# EAGLE design Schematics (EAGLE 8.7.1)
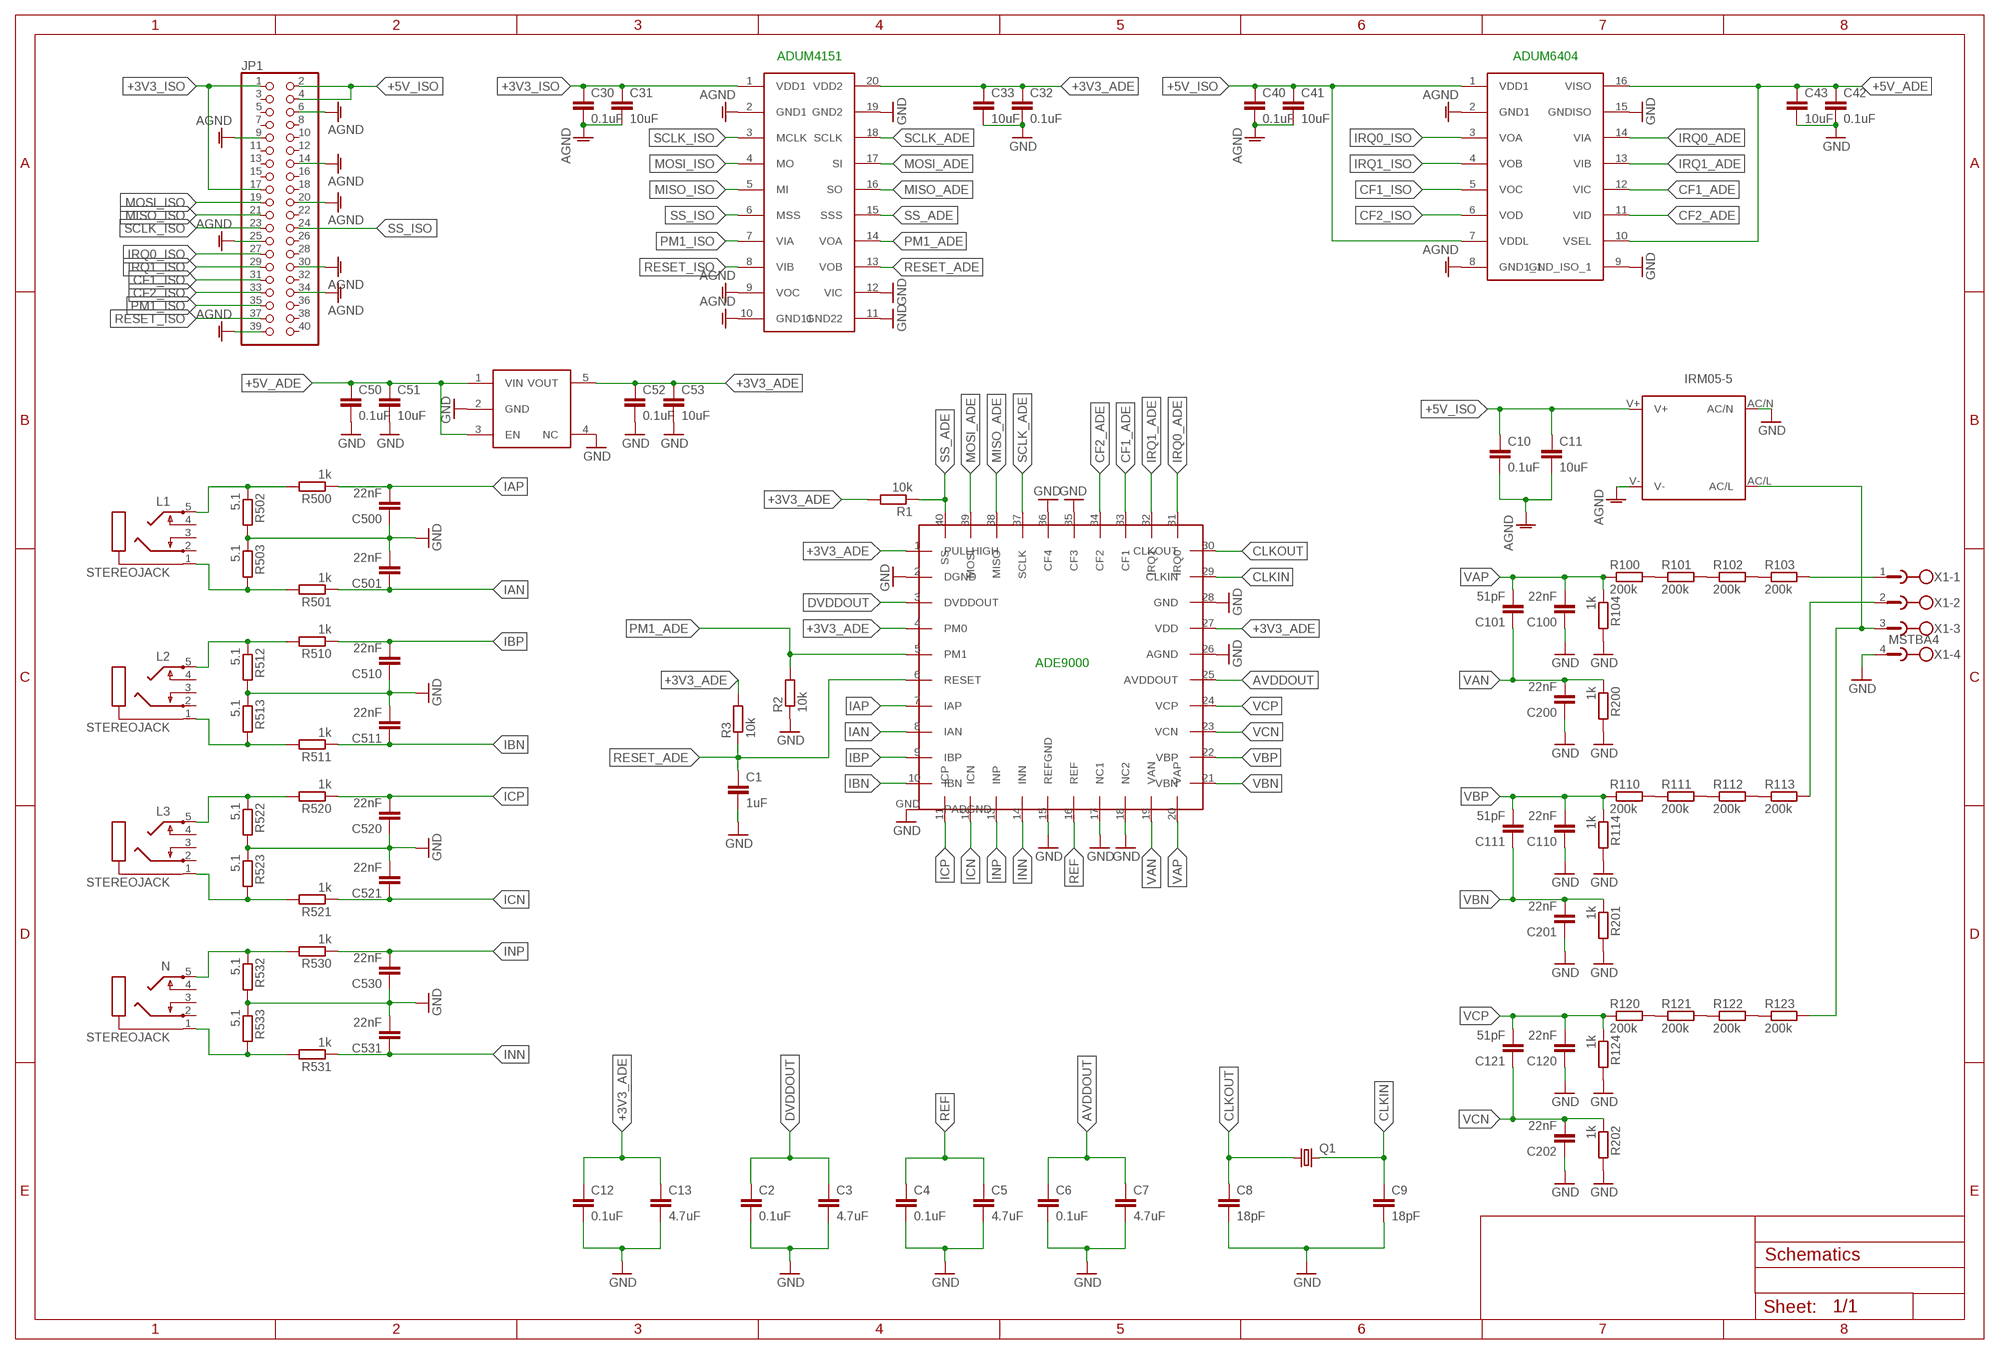
[diagram p0: schematic, sheet 1]

## Parts
ADE9000  ADE9000  [LFCSP40]
ADUM4151  ADUM4151  [SOIC20R]
ADUM6404  ADUM6404  [SOIC16R]
C1  1uF  C-EUC0805  [C0805]
C2  0.1uF  C-EUC0805  [C0805]
C3  4.7uF  C-EUC0805  [C0805]
C4  0.1uF  C-EUC0805  [C0805]
C5  4.7uF  C-EUC0805  [C0805]
C6  0.1uF  C-EUC0805  [C0805]
C7  4.7uF  C-EUC0805  [C0805]
C8  18pF  C-EUC0805  [C0805]
C9  18pF  C-EUC0805  [C0805]
C10  0.1uF  C-EUC0805  [C0805]
C11  10uF  C-EUC0805  [C0805]
C12  0.1uF  C-EUC0805  [C0805]
C13  4.7uF  C-EUC0805  [C0805]
C30  0.1uF  C-EUC0805  [C0805]
C31  10uF  C-EUC0805  [C0805]
C32  0.1uF  C-EUC0805  [C0805]
C33  10uF  C-EUC0805  [C0805]
C40  0.1uF  C-EUC0805  [C0805]
C41  10uF  C-EUC0805  [C0805]
C42  0.1uF  C-EUC0805  [C0805]
C43  10uF  C-EUC0805  [C0805]
C50  0.1uF  C-EUC0805  [C0805]
C51  10uF  C-EUC0805  [C0805]
C52  0.1uF  C-EUC0805  [C0805]
C53  10uF  C-EUC0805  [C0805]
C100  22nF  C-EUC0805  [C0805]
C101  51pF  C-EUC0805  [C0805]
C110  22nF  C-EUC0805  [C0805]
C111  51pF  C-EUC0805  [C0805]
C120  22nF  C-EUC0805  [C0805]
C121  51pF  C-EUC0805  [C0805]
C200  22nF  C-EUC0805  [C0805]
C201  22nF  C-EUC0805  [C0805]
C202  22nF  C-EUC0805  [C0805]
C500  22nF  C-EUC0805  [C0805]
C501  22nF  C-EUC0805  [C0805]
C510  22nF  C-EUC0805  [C0805]
C511  22nF  C-EUC0805  [C0805]
C520  22nF  C-EUC0805  [C0805]
C521  22nF  C-EUC0805  [C0805]
C530  22nF  C-EUC0805  [C0805]
C531  22nF  C-EUC0805  [C0805]
IRM05-5  IRM_05/10  [IRM_05/10]
JP1  PINHD-2X20  [2X20]
L1  STEREOJACK  [STX3100]
L2  STEREOJACK  [STX3100]
L3  STEREOJACK  [STX3100]
N  STEREOJACK  [STX3100]
Q1  CRYSTALCTS406  [CTS406]
R1  10k  R-EU_M0805  [M0805]
R2  10k  R-EU_M0805  [M0805]
R3  10k  R-EU_M0805  [M0805]
R100  200k  R-EU_M1206  [M1206]
R101  200k  R-EU_M1206  [M1206]
R102  200k  R-EU_M1206  [M1206]
R103  200k  R-EU_M1206  [M1206]
R104  1k  R-EU_M0805  [M0805]
R110  200k  R-EU_M1206  [M1206]
R111  200k  R-EU_M1206  [M1206]
R112  200k  R-EU_M1206  [M1206]
R113  200k  R-EU_M1206  [M1206]
R114  1k  R-EU_M0805  [M0805]
R120  200k  R-EU_M1206  [M1206]
R121  200k  R-EU_M1206  [M1206]
R122  200k  R-EU_M1206  [M1206]
R123  200k  R-EU_M1206  [M1206]
R124  1k  R-EU_M0805  [M0805]
R200  1k  R-EU_M0805  [M0805]
R201  1k  R-EU_M0805  [M0805]
R202  1k  R-EU_M0805  [M0805]
R500  1k  R-EU_M0805  [M0805]
R501  1k  R-EU_M0805  [M0805]
R502  5.1  R-EU_M0805  [M0805]
R503  5.1  R-EU_M0805  [M0805]
R510  1k  R-EU_M0805  [M0805]
R511  1k  R-EU_M0805  [M0805]
R512  5.1  R-EU_M0805  [M0805]
R513  5.1  R-EU_M0805  [M0805]
R520  1k  R-EU_M0805  [M0805]
R521  1k  R-EU_M0805  [M0805]
R522  5.1  R-EU_M0805  [M0805]
R523  5.1  R-EU_M0805  [M0805]
R530  1k  R-EU_M0805  [M0805]
R531  1k  R-EU_M0805  [M0805]
R532  5.1  R-EU_M0805  [M0805]
R533  5.1  R-EU_M0805  [M0805]
U$5  ADP122AUJZ-3.3-R7  [TSOT23-5L]
X1  MSTBA4  [MSTBA4]

## Nets
+3V3_ADE: ADE9000.1(PULLHIGH) ADE9000.4(PM0) ADE9000.27(VDD) ADUM4151.20(VDD2) C12.1 C13.1 C32.1 C33.1 C52.1 C53.1 R1.2 R3.2 U$5.5(VOUT)
+3V3_ISO: ADUM4151.1(VDD1) C30.1 C31.1 JP1.1 JP1.17
+5V_ADE: ADUM6404.10(VSEL) ADUM6404.16(VISO) C42.1 C43.1 C50.1 C51.1 U$5.1(VIN) U$5.3(EN)
+5V_ISO: ADUM6404.1(VDD1) ADUM6404.7(VDDL) C10.1 C11.1 C40.1 C41.1 IRM05-5.V+ JP1.2 JP1.4
AGND: ADUM4151.2(GND1) ADUM4151.9(VOC) ADUM4151.10(GND11) ADUM6404.2(GND1) ADUM6404.8(GND1_1) C10.2 C11.2 C30.2 C31.2 C40.2 C41.2 IRM05-5.V- JP1.6 JP1.9 JP1.14 JP1.20 JP1.25 JP1.30 JP1.34 JP1.39
AVDDOUT: ADE9000.25(AVDDOUT) C6.1 C7.1
CF1_ADE: ADE9000.33(CF1) ADUM6404.12(VIC)
CF1_ISO: ADUM6404.5(VOC) JP1.31
CF2_ADE: ADE9000.34(CF2) ADUM6404.11(VID)
CF2_ISO: ADUM6404.6(VOD) JP1.33
CLKIN: ADE9000.29(CLKIN) C9.1 Q1.3
CLKOUT: ADE9000.30(CLKOUT) C8.1 Q1.1
DVDDOUT: ADE9000.3(DVDDOUT) C2.1 C3.1
GND: ADE9000.2(DGND) ADE9000.15(REFGND) ADE9000.17(NC1) ADE9000.18(NC2) ADE9000.26(AGND) ADE9000.28(GND) ADE9000.35(CF3) ADE9000.36(CF4) ADE9000.GND(PADGND) ADUM4151.11(GND22) ADUM4151.12(VIC) ADUM4151.19(GND2) ADUM6404.9(GND_ISO_1) ADUM6404.15(GNDISO) C1.2 C2.2 C3.2 C4.2 C5.2 C6.2 C7.2 C8.2 C9.2 C12.2 C13.2 C32.2 C33.2 C42.2 C43.2 C50.2 C51.2 C52.2 C53.2 C100.1 C110.1 C120.1 C200.1 C201.1 C202.1 C500.1 C501.2 C510.1 C511.2 C520.1 C521.2 C530.1 C531.2 IRM05-5.AC/N R2.1 R104.2 R114.2 R124.2 R200.2 R201.2 R202.2 R502.2 R503.1 R512.2 R513.1 R522.2 R523.1 R532.2 R533.1 U$5.2(GND) U$5.4(NC) X1.4
IAN: ADE9000.8(IAN) C501.1 R501.1
IAP: ADE9000.7(IAP) C500.2 R500.1
IBN: ADE9000.10(IBN) C511.1 R511.1
IBP: ADE9000.9(IBP) C510.2 R510.1
ICN: ADE9000.12(ICN) C521.1 R521.1
ICP: ADE9000.11(ICP) C520.2 R520.1
INN: ADE9000.14(INN) C531.1 R531.1
INP: ADE9000.13(INP) C530.2 R530.1
IRQ0_ADE: ADE9000.31(IRQ0) ADUM6404.14(VIA)
IRQ0_ISO: ADUM6404.3(VOA) JP1.27
IRQ1_ADE: ADE9000.32(IRQ1) ADUM6404.13(VIB)
IRQ1_ISO: ADUM6404.4(VOB) JP1.29
MISO_ADE: ADE9000.38(MISO) ADUM4151.16(SO)
MISO_ISO: ADUM4151.5(MI) JP1.21
MOSI_ADE: ADE9000.39(MOSI) ADUM4151.17(SI)
MOSI_ISO: ADUM4151.4(MO) JP1.19
N$1: R121.2 R122.1
N$3: R102.2 R103.1
N$4: R103.2 X1.1
N$10: L1.5 R500.2 R502.1
N$11: L1.1 R501.2 R503.2
N$12: L2.5 R510.2 R512.1
N$13: L2.1 R511.2 R513.2
N$14: L3.5 R520.2 R522.1
N$15: L3.1 R521.2 R523.2
N$16: N.5 R530.2 R532.1
N$17: N.1 R531.2 R533.2
N$18: R101.2 R102.1
N$19: R111.2 R112.1
N$20: R112.2 R113.1
N$21: R122.2 R123.1
N$22: R113.2 X1.2
N$23: IRM05-5.AC/L R123.2 X1.3
N$29: R110.2 R111.1
N$30: R100.2 R101.1
N$31: R120.2 R121.1
PM1_ADE: ADE9000.5(PM1) ADUM4151.14(VOA) R2.2
PM1_ISO: ADUM4151.7(VIA) JP1.35
REF: ADE9000.16(REF) C4.1 C5.1
RESET_ADE: ADE9000.6(RESET) ADUM4151.13(VOB) C1.1 R3.1
RESET_ISO: ADUM4151.8(VIB) JP1.37
SCLK_ADE: ADE9000.37(SCLK) ADUM4151.18(SCLK)
SCLK_ISO: ADUM4151.3(MCLK) JP1.23
SS_ADE: ADE9000.40(SS) ADUM4151.15(SSS) R1.1
SS_ISO: ADUM4151.6(MSS) JP1.24
VAN: ADE9000.19(VAN) C101.1 C200.2 R200.1
VAP: ADE9000.20(VAP) C100.2 C101.2 R100.1 R104.1
VBN: ADE9000.21(VBN) C111.1 C201.2 R201.1
VBP: ADE9000.22(VBP) C110.2 C111.2 R110.1 R114.1
VCN: ADE9000.23(VCN) C121.1 C202.2 R202.1
VCP: ADE9000.24(VCP) C120.2 C121.2 R120.1 R124.1
Unconnected: JP1.3 JP1.5 JP1.7 JP1.8 JP1.10 JP1.11 JP1.12 JP1.13 JP1.15 JP1.16 JP1.18 JP1.22 JP1.26 JP1.28 JP1.32 JP1.36 JP1.38 JP1.40 L1.2 L1.3 L1.4 L2.2 L2.3 L2.4 L3.2 L3.3 L3.4 N.2 N.3 N.4

## Notes on the sheet
- ADUM4151 | ADUM6404
- ADE9000

## Library data of the parts
ADE9000 = Schematics:ADE9000
ADUM4151 = Schematics:ADUM4151
ADUM6404 = Schematics:ADUM6404
C1-C13 C30-C33 C40-C43 C50-C53 C100 C101 C110 C111 C120 C121 C200-C202 C500 C501 C510 C511 C520 C521 C530 C531 = Schematics:C-EU: CAPACITOR, European symbol
IRM05-5 = Schematics:IRM_05/10: 5 or 10 watt housing & pin compatible IRM 05 Vout [V] Imax [A] Pmax [W] Eff [%] 3.3 1.25 4.125 68 5 1 5 71 12 0.42 5.04 75 15 0.33 4.95 75 24 0.23 5.52 77 IRM 10 Vout [V] Imax [A] Pmax [W] Eff [%] 3.3 2.5 8.25 74 5 2 10 77 12 0.85 10.2 82 15 0.67 10.05 82 24 0.42 10.08 82
JP1 = Schematics:PINHD-2X20: PIN HEADER
L1-L3 N = Schematics:STEREOJACK: MIC/HEADPHONE JACK Stereo jack with two switches. Kycon STX3100, CUI SJ1-3555NG and/or 4UCon 05544
Q1 = Schematics:CRYSTAL: CRYSTAL; OC_FARNELL: unknown; OC_NEWARK: unknown
R1-R3 R100-R104 R110-R114 R120-R124 R200-R202 R500-R503 R510-R513 R520-R523 R530-R533 = Schematics:R-EU_: RESISTOR, European symbol
U$5 = Schematics:ADP122AUJZ-3.3-R7
X1 = Schematics:MSTBA4: PHOENIX; MF: FARNELL; MPN: 1757268; OC_FARNELL: 3705195; OC_NEWARK: 71C4163

## Board
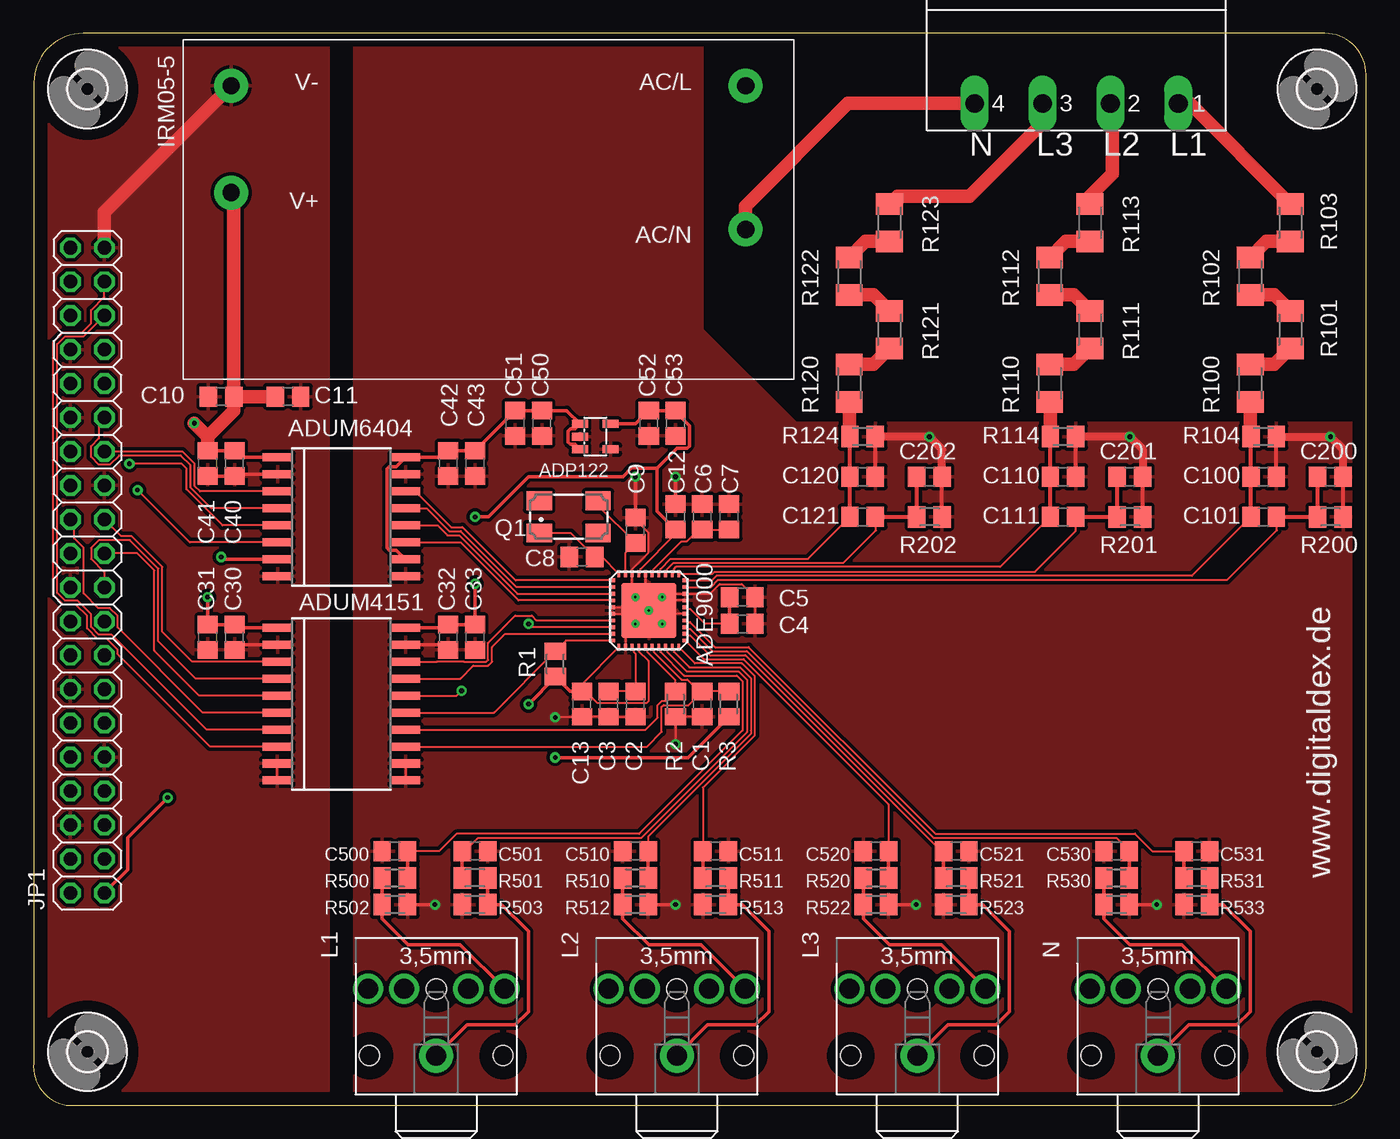
[diagram p1: board, top side]
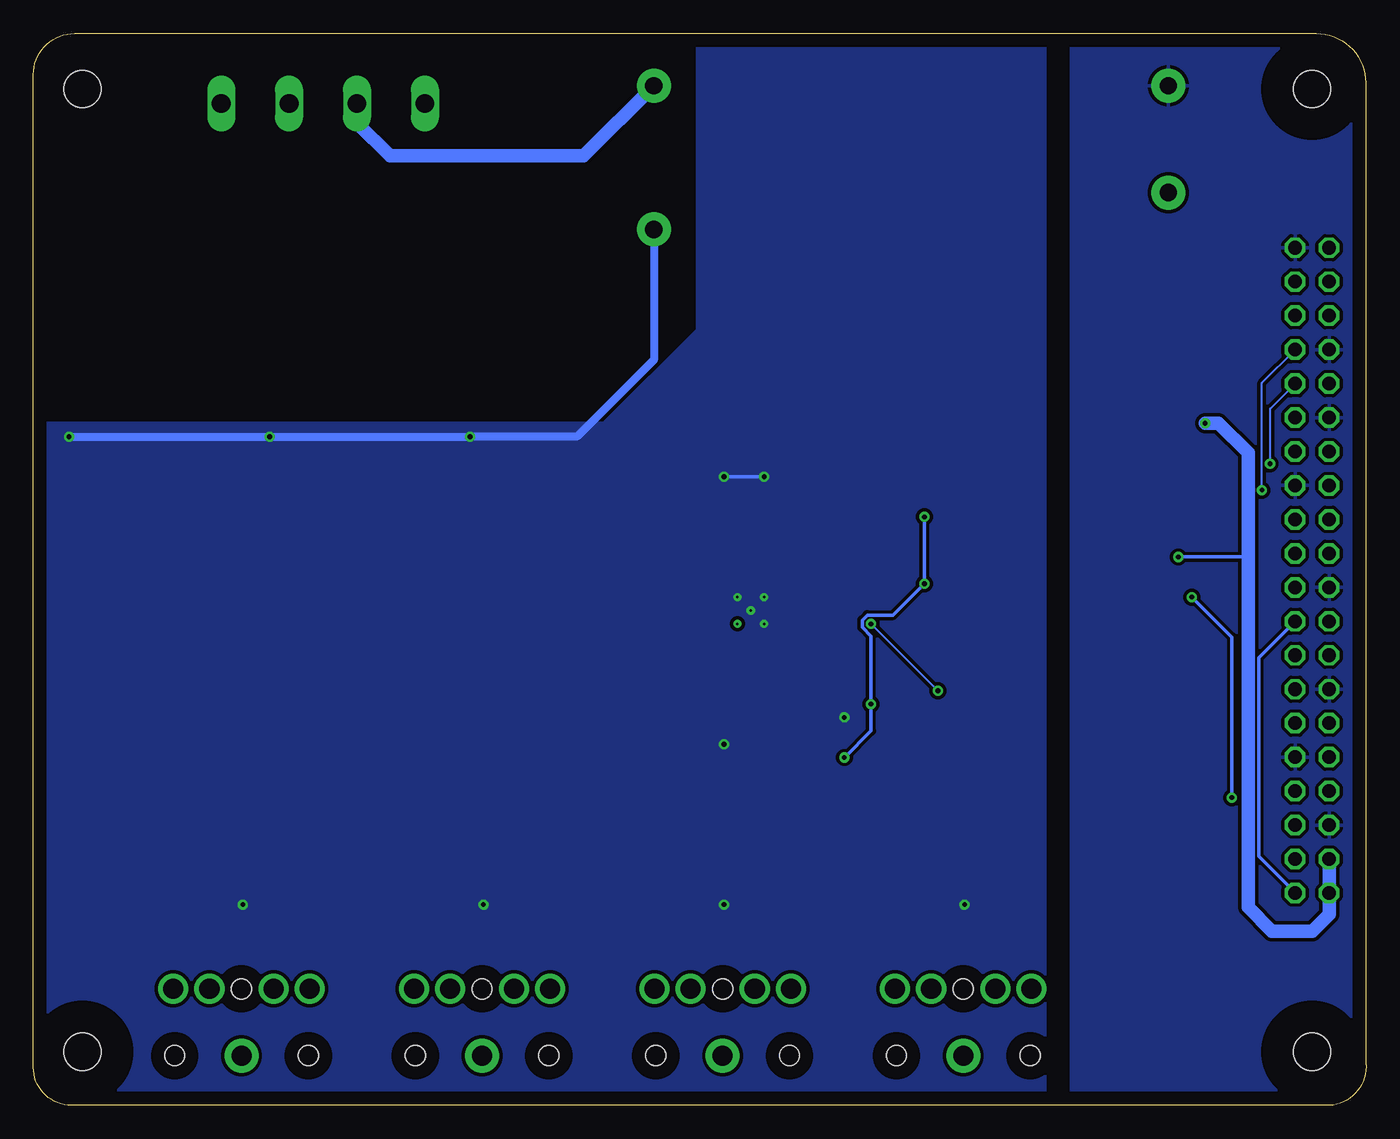
[diagram p2: board, bottom side, seen from below]

Size 99.71 x 80.16 mm. Coordinates in mm from the lower left corner, seen from the top.
Outline: 96.64,80.16 3.73,80.16 arc90 0.04,76.48 0.04,3.41 arc90 2.46,0 96.88,0 arc90 99.71,2.83 99.71,77.08 arc90 96.64,80.16
Copper layers (1*16): Top 0.035mm / dielectric 1.5mm / Bottom 0.035mm
Design rules "default": minimum track width 6mil, minimum drill 0.35mm, track to track 6mil, track to pad 6mil, pad to pad 6mil, via to via 6mil, smd to smd 6mil, copper to edge 40mil, drill to drill 6mil, minimum pad ring 10mil, minimum via ring 8mil, stop-mask expansion 4mil, vias tented up to drill 0mil, thermal gap 10mil

### Footprints (pad centres in the part's own frame; a part is rotated, then mirrored left to right if it is on the bottom)
LFCSP40 = smd 0.55 x 0.3: 1 -2.75,2.25; 2 -2.75,1.75; 3 -2.75,1.25; 4 -2.75,0.75; 5 -2.75,0.25; 6 -2.75,-0.25; 7 -2.75,-0.75; 8 -2.75,-1.25; 9 -2.75,-1.75; 10 -2.75,-2.25; 21 2.75,-2.25; 22 2.75,-1.75; 23 2.75,-1.25; 24 2.75,-0.75; 25 2.75,-0.25; 26 2.75,0.25; 27 2.75,0.75; 28 2.75,1.25; 29 2.75,1.75; 30 2.75,2.25 | smd 0.3 x 0.55: 11 -2.25,-2.75; 12 -1.75,-2.75; 13 -1.25,-2.75; 14 -0.75,-2.75; 15 -0.25,-2.75; 16 0.25,-2.75; 17 0.75,-2.75; 18 1.25,-2.75; 19 1.75,-2.75; 20 2.25,-2.75; 31 2.25,2.75; 32 1.75,2.75; 33 1.25,2.75; 34 0.75,2.75; 35 0.25,2.75; 36 -0.25,2.75; 37 -0.75,2.75; 38 -1.25,2.75; 39 -1.75,2.75; 40 -2.25,2.75 | smd 4.1 x 4.1: GND 0,0
SOIC20R = smd 0.6 x 2.2: 1 -5.715,-4.775; 2 -4.445,-4.775; 3 -3.175,-4.775; 4 -1.905,-4.775; 5 -0.635,-4.775; 6 0.635,-4.775; 7 1.905,-4.775; 8 3.175,-4.775; 9 4.445,-4.8; 10 5.715,-4.8; 11 5.715,4.8; 12 4.445,4.8; 13 3.175,4.8; 14 1.905,4.8; 15 0.635,4.8; 16 -0.635,4.8; 17 -1.905,4.8; 18 -3.175,4.8; 19 -4.445,4.8; 20 -5.715,4.8
SOIC16R = smd 0.6 x 2.2: 1 -4.445,-4.775; 2 -3.175,-4.775; 3 -1.905,-4.775; 4 -0.635,-4.775; 5 0.635,-4.775; 6 1.905,-4.775; 7 3.175,-4.775; 8 4.445,-4.775; 9 4.445,4.8; 10 3.175,4.8; 11 1.905,4.8; 12 0.635,4.8; 13 -0.635,4.8; 14 -1.905,4.8; 15 -3.175,4.8; 16 -4.445,4.8
C0805 = smd 1.3 x 1.5: 1 -0.95,0; 2 0.95,0
IRM_05/10 = drill 1.3 pad 2.54: AC/L -19.25,-9.25; AC/N -19.25,1.5; V+ 19.25,-1.25; V- 19.25,-9.25
2X20 = drill 1.016 octagon: 1 -24.13,-1.27; 2 -24.13,1.27; 3 -21.59,-1.27; 4 -21.59,1.27; 5 -19.05,-1.27; 6 -19.05,1.27; 7 -16.51,-1.27; 8 -16.51,1.27; 9 -13.97,-1.27; 10 -13.97,1.27; 11 -11.43,-1.27; 12 -11.43,1.27; 13 -8.89,-1.27; 14 -8.89,1.27; 15 -6.35,-1.27; 16 -6.35,1.27; 17 -3.81,-1.27; 18 -3.81,1.27; 19 -1.27,-1.27; 20 -1.27,1.27; 21 1.27,-1.27; 22 1.27,1.27; 23 3.81,-1.27; 24 3.81,1.27; 25 6.35,-1.27; 26 6.35,1.27; 27 8.89,-1.27; 28 8.89,1.27; 29 11.43,-1.27; 30 11.43,1.27; 31 13.97,-1.27; 32 13.97,1.27; 33 16.51,-1.27; 34 16.51,1.27; 35 19.05,-1.27; 36 19.05,1.27; 37 21.59,-1.27; 38 21.59,1.27; 39 24.13,-1.27; 40 24.13,1.27
STX3100 = drill 1.5 pad 2.54: 1 2.7,-0.1 | drill 1.5: 2 7.7,5; 3 7.7,2.3; 4 7.7,-2.5; 5 7.7,-5.2 | hole 1.5: 2.7,4.9; 2.7,-5.1; 7.7,-0.1
CTS406 = smd 1.9 x 1.4: 1 -2.2,-1.2; 2 2.2,-1.2; 3 2.2,1.2; 4 -2.2,1.2
M0805 = smd 1.3 x 1.6: 1 -0.95,0; 2 0.95,0
M1206 = smd 1.6 x 2: 1 -1.4,0; 2 1.4,0
2,8 = hole 2.8: 0,0
TSOT23-5L = smd 0.6 x 1.2: 1 -0.95,-1.15; 2 0,-1.15; 3 0.95,-1.15; 4 0.95,1.15; 5 -0.95,1.15
MSTBA4 = drill 1.397 long: 1 -7.62,5.08; 2 -2.54,5.08; 3 2.54,5.08; 4 7.62,5.08

### Placement (x,y rotation side)
ADE9000  46.04,37 90 top
ADUM4151  23.04,30 270 top
ADUM6404  23.04,44 270 top
C1  50.04,30 270 top
C2  45.04,30 270 top
C3  43.04,30 270 top
C4  53.04,36 0 top
C5  53.04,38 0 top
C6  50.04,44 90 top
C7  52.04,44 90 top
C8  41.04,41 180 top
C9  45.04,43 90 top
C10  14.04,53 180 top
C11  19.04,53 0 top
C12  48.04,44 90 top
C13  41.04,30 270 top
C30  15.04,35 270 top
C31  13.04,35 270 top
C32  31.04,35 270 top
C33  33.04,35 270 top
C40  15.04,48 270 top
C41  13.04,48 270 top
C42  31.04,48 270 top
C43  33.04,48 270 top
C50  38.04,51 270 top
C51  36.04,51 270 top
C52  46.04,51 270 top
C53  48.04,51 270 top
C100  92.04,47 180 top
C101  92.04,44 180 top
C110  77.04,47 180 top
C111  77.04,44 180 top
C120  62.04,47 180 top
C121  62.04,44 180 top
C200  97.04,47 180 top
C201  82.04,47 180 top
C202  67.04,47 180 top
C500  27.04,19 0 top
C501  33.04,19 0 top
C510  45.04,19 0 top
C511  51.04,19 0 top
C520  63.04,19 0 top
C521  69.04,19 0 top
C530  81.04,19 0 top
C531  87.04,19 0 top
IRM05-5  34.04,67 180 top
JP1  4.04,40 90 top
L1  30.04,1 90 top
L2  48.04,1 90 top
L3  66.04,1 90 top
N  84.04,1 90 top
Q1  40.04,44 0 top
R1  39.04,33 270 top
R2  48.04,30 90 top
R3  52.04,30 270 top
R100  91.04,54 90 top
R101  94.04,58 90 top
R102  91.04,62 90 top
R103  94.04,66 90 top
R104  92.04,50 0 top
R110  76.04,54 90 top
R111  79.04,58 90 top
R112  76.04,62 90 top
R113  79.04,66 90 top
R114  77.04,50 0 top
R120  61.04,54 90 top
R121  64.04,58 90 top
R122  61.04,62 90 top
R123  64.04,66 90 top
R124  62.04,50 0 top
R200  97.04,44 0 top
R201  82.04,44 0 top
R202  67.04,44 0 top
R500  27.04,17 180 top
R501  33.04,17 0 top
R502  27.04,15 0 top
R503  33.04,15 0 top
R510  45.04,17 180 top
R511  51.04,17 0 top
R512  45.04,15 0 top
R513  51.04,15 0 top
R520  63.04,17 180 top
R521  69.04,17 0 top
R522  63.04,15 0 top
R523  69.04,15 0 top
R530  81.04,17 180 top
R531  87.04,17 0 top
R532  81.04,15 0 top
R533  87.04,15 0 top
U$1  [2,8]  4.04,76 0 top
U$2  [2,8]  4.04,4 0 top
U$3  [2,8]  96.04,4 0 top
U$4  [2,8]  96.04,76 0 top
U$5  42.04,50 270 top
X1  78.04,80 180 top

### Tracks (layer width: path | path; a pad name or v marks a point on that pad's centre or on a via)
+3V3_ADE  (via drill 0.35)
  Top 0.152: ADE9000.27 45.41,39.87 45.41,40.09 48.04,42.72 C12.1 | ADE9000.1 41.04,31.5 C13.1 41.32,30.95 42.2,30.07 45.89,30.07 46.02,30.2 46.02,33.23 45.29,33.96 ADE9000.4
  Top 0.254: C12.1 46.67,44.42 46.67,47.63 | 39.07,32.02 R1.2 | 39.07,32.02 40.14,30.95 C13.1 | ADUM4151.20 30.81,35.72 C32.1 C33.1 v33.04,39 | R3.2 48.99,26 v39.04,26 | v37.04,30 39.07,32.02 | 46.67,47.63 45.34,47.63 45.31,47.66 44.77,47.66 44.11,47 37.04,47 34.04,44 v33.04,44 | U$5.5 45.04,50.95 C52.1 C53.1 48.04,51.84 49.07,50.82 49.07,49.28 48.91,49.12 48.16,49.12 46.67,47.63
  Bottom 0.254: v33.04,44 v33.04,39 35.38,36.66 37.31,36.66 37.7,36.27 37.7,35.73 37.04,35.07 v37.04,30 37.04,28 v39.04,26
+3V3_ISO  (via drill 0.35)
  Top 0.254: ADUM4151.1 15.28,35.72 C30.1 C31.1 v13.04,38 | JP1.1 7.04,17.6 7.04,20 v10.04,23
  Bottom 0.254: v13.04,38 10.04,35 v10.04,23 | JP1.1 8.04,18.6 8.04,33.46 JP1.17
+5V_ADE
  Top 0.254: C42.1 C43.1 C51.1 C50.1 39.89,51.95 U$5.1 40.52,50.58 40.18,50.58 40.01,50.42 40.01,49.58 40.18,49.42 40.52,49.42 U$5.3 | 30.54,48.45 C42.1 | C42.1 31.04,48.84 | 30.54,48.45 ADUM6404.16 27.15,47.75 26.63,47.75 26.46,47.59 26.46,41.68 26.63,41.52 27.15,41.52 ADUM6404.10 | 30.54,48.45 C42.1
+5V_ISO  (via drill 0.35)
  Top 0.254: C41.1 C40.1 15.55,48.45 ADUM6404.1 | ADUM6404.7 14.22,40.83 v14.04,41
  Top 1.016: IRM05-5.V+ 14.99,68.05 C10.1 | C11.1 C10.1 | C10.1 14.99,51.95 13.04,50 | 13.04,50 C41.1 | 13.04,50 v12.04,51
  Bottom 0.254: v14.04,41 8.83,41
  Bottom 1.016: v12.04,51 11.04,51 8.83,48.79 8.83,41 8.83,14.79 7.04,13 4.04,13 2.77,14.27 JP1.2 JP1.4
AGND
  Top 0.152: ADUM4151.10 ADUM4151.9
  Top 0.254: ADUM4151.2 15.44,34.45 C30.2 | C41.2 C40.2 15.17,47.17 ADUM6404.2
  Top 1.016: JP1.39 5.31,66.77 IRM05-5.V-
  pour Top (isolate 0.254): 22.04,80 22.04,0 0.04,0 0.04,80
  pour Bottom (isolate 0.254): 0.04,80 22.04,80 22.04,0 0.04,0
AVDDOUT
  Top 0.152: ADE9000.25 46.41,39.87 46.41,40.09 48.49,42.17 48.89,42.17 49.77,43.05 C6.1 C7.1
CF1_ADE
  Top 0.152: ADE9000.33 36.22,38.25 31.85,42.62 30.99,42.62 30.25,43.37 ADUM6404.12
CF1_ISO  (via drill 0.35)
  Top 0.152: ADUM6404.5 14.14,43.37 11.45,46.05 11.45,47.59 11.04,48 11.02,47.98 v7.18,47.98
  Bottom 0.152: v7.18,47.98 7.18,52.1 JP1.31
CF2_ADE
  Top 0.152: ADE9000.34 36.29,37.75 31.95,42.09 ADUM6404.11
CF2_ISO  (via drill 0.35)
  Top 0.152: ADUM6404.6 15.04,42.09 14.95,42.09 11.7,42.09 v7.79,46
  Bottom 0.152: v7.79,46 7.79,54.03 JP1.33
CLKIN
  Top 0.152: ADE9000.29 44.29,41.3 C9.1 42.24,44.85 Q1.3
CLKOUT
  Top 0.152: ADE9000.30 42.54,41 C8.1 40.19,42.8 Q1.1
DVDDOUT
  Top 0.152: ADE9000.3 44.91,34.13 44.91,33.91 45.04,33.78 C2.1 C3.1
GND  (via drill 0.2, 0.35)
  Top 0.152: 45.79,37.25 ADE9000.26 45.79,38.5 45.51,38.22 45.51,37.53 45.79,37.25 | ADE9000.GND v45.04,38 44.79,38.25 ADE9000.28 44.79,40.08 46.02,41.3 46.02,42.8 45.04,43.77 C9.2 | ADE9000.15 46.29,36.75 ADE9000.GND | ADE9000.35 45.79,37.25 | ADE9000.36 45.79,36.75 ADE9000.GND | ADE9000.2 44.29,35.25 v45.04,36 ADE9000.GND | ADE9000.GND v47.04,38 47.29,38.25 ADE9000.18 50.62,38.25 51.35,38.98 53.01,38.98 C5.2 C4.2 | ADE9000.17 46.79,37.75 ADE9000.GND | C2.2 C3.2 C13.2 40.99,29 v39.04,29 | ADUM4151.12 ADUM4151.11 | C1.2 R2.1 v48.04,27 | 45.79,37.25 ADE9000.GND
  Top 0.254: 30.92,47.17 C42.2 | ADUM4151.19 30.65,34.45 C32.2 | C12.2 v48.04,47 | v45.04,47 C9.2 | R502.2 v30.04,15 | R512.2 v48.04,15 | R522.2 v66.04,15 | R532.2 v84.04,15
  Top 0.305: C120.1 R124.2 | R202.2 C202.1 | R201.2 C201.1 | C110.1 R114.2 | C100.1 R104.2 | R200.2 C200.1
  Top 0.61: R104.2 v97.04,50 97.99,49.05 C200.1 | R114.2 v82.04,50 82.99,49.05 C201.1 | R124.2 v67.04,50 67.99,49.05 C202.1
  Top 1.016: IRM05-5.AC/N 53.29,67.25 60.96,74.92 X1.4
  Bottom 0.254: v48.04,47 v45.04,47
  Bottom 0.61: v97.04,50 v82.04,50 v67.04,50 59.04,50 53.29,55.75 IRM05-5.AC/N
  other vias: 46.04,37
  pour Top (isolate 0.254): 50.04,80 50.04,58 57.04,51 100.04,51 100.04,0 24.04,0 24.04,80
  pour Bottom (isolate 0.254): 24.04,0 100.04,0 100.04,51 57.04,51 50.04,58 50.04,80 24.04,80
IAN
  Top 0.152: ADE9000.8 47.41,34.13 47.41,33.91 48.88,32.44 52.76,32.44 53.38,31.82 53.38,27.9 45.45,19.98 33.25,19.98 32.27,19 C501.1
  Top 0.254: R501.1 C501.1
IAP
  Top 0.152: ADE9000.7 46.91,34.13 46.91,33.91 48.69,32.13 52.63,32.13 53.07,31.7 53.07,28.03 45.33,20.28 31.65,20.28 30.37,19 C500.2
  Top 0.254: R500.1 C500.2
IBN
  Top 0.152: ADE9000.10 49.49,33.05 53.01,33.05 53.99,32.07 53.99,27.65 50.09,23.76 C511.1
  Top 0.254: R511.1 C511.1
IBP
  Top 0.152: ADE9000.9 47.91,34.13 47.91,33.91 49.08,32.74 52.88,32.74 53.68,31.95 53.68,28.03 | 53.68,28.03 | 53.68,28.03 53.68,27.78 45.99,20.09 C510.2
  Top 0.254: R510.1 C510.2
ICN
  Top 0.152: ADE9000.12 48.91,35.13 49.14,35.13 50.61,33.66 53.26,33.66 67.92,19 C521.1
  Top 0.254: R521.1 C521.1
ICP
  Top 0.152: ADE9000.11 50.19,33.35 53.14,33.35 63.99,22.5 C520.2
  Top 0.254: R520.1 C520.2
INN
  Top 0.152: ADE9000.14 48.91,36.13 49.14,36.13 51,34.27 53.52,34.27 67.48,20.3 82.41,20.3 83.72,19 86.04,19 C531.1
  Top 0.254: R531.1 86.09,18.95 86.04,19
INP
  Top 0.152: ADE9000.13 48.91,35.63 49.14,35.63 50.8,33.96 53.39,33.96 67.35,20 81.04,20 81.99,19.05 C530.2
  Top 0.254: R530.1 81.99,19.05
IRQ0_ADE
  Top 0.152: ADE9000.31 36.09,39.25 32.1,43.23 31.24,43.23 28.57,45.91 ADUM6404.14
IRQ0_ISO
  Top 0.152: ADUM6404.3 12.46,45.91 12.06,46.3 12.06,47.98 11.15,48.89 JP1.27
IRQ1_ADE
  Top 0.152: ADE9000.32 36.15,38.75 31.98,42.93 31.11,42.93 29.41,44.63 ADUM6404.13
IRQ1_ISO
  Top 0.152: ADUM6404.4 13.3,44.63 11.76,46.18 11.76,47.85 11.03,48.59 6.41,48.59 5.72,47.9 4.9,47.9 4.32,48.48 4.32,49.3 4.9,49.88 4.9,51.02 JP1.29
MISO_ADE  (via drill 0.35)
  Top 0.152: ADE9000.38 37.29,35.75 v37.04,36 | ADUM4151.16 31.68,30.64 v32.04,31
  Bottom 0.152: v37.04,36 v32.04,31
MISO_ISO
  Top 0.152: ADUM4151.5 12.41,30.64 9.04,34 9.04,40 7.77,41.27 JP1.21
MOSI_ADE
  Top 0.152: ADE9000.39 35.29,35.25 34.33,34.28 34.33,33.18 34.01,32.87 32.91,32.87 31.95,31.91 ADUM4151.17
MOSI_ISO
  Top 0.152: ADUM4151.4 12.14,31.91 9.35,34.7 9.35,40.13 7.21,42.26 4.9,42.26 4.32,41.68 4.32,40.86 5.31,39.87 JP1.19
N$1
  Top 1.016: R121.2 62.84,60.6 R122.1
N$3
  Top 1.016: R102.2 92.24,64.6 R103.1
N$4
  Top 1.016: 93.8,67.4 R103.2 86.52,74.92 X1.1
N$8  (via drill 0.2)
  other vias: 47.04,36
N$10
  Top 0.254: L1.5 31.94,12 28.04,12 26.09,13.95 R502.1 R500.2
N$11
  Top 0.254: L1.1 32.44,6 36.04,6 37.04,7 37.04,13 35.04,15 R503.2 R501.2
N$12
  Top 0.254: L2.5 49.94,12 46.04,12 44.09,13.95 R512.1 R510.2
N$13
  Top 0.254: L2.1 50.44,6 54.04,6 55.04,7 55.04,13 53.04,15 R513.2 R511.2
N$14
  Top 0.254: R520.2 R522.1 62.09,13.95 64.04,12 67.94,12 L3.5
N$15
  Top 0.254: R521.2 R523.2 71.04,15 73.04,13 73.04,7 72.04,6 68.44,6 L3.1
N$16
  Top 0.254: R530.2 R532.1 80.09,13.95 82.04,12 85.94,12 N.5
N$17
  Top 0.254: R531.2 R533.2 89.04,15 91.04,13 91.04,7 90.04,6 86.44,6 N.1
N$18
  Top 1.016: R101.2 92.84,60.6 R102.1
N$19
  Top 1.016: R111.2 77.84,60.6 R112.1
N$20
  Top 1.016: R112.2 77.24,64.6 R113.1
N$21
  Top 1.016: R122.2 62.24,64.6 R123.1
N$22
  Top 1.016: R113.2 79.04,68 80.72,69.68 80.72,74.78 X1.2
N$23
  Top 1.016: R123.2 64.64,68 70.04,68 75.5,73.46 X1.3
  Bottom 1.016: IRM05-5.AC/L 58.54,71 73.04,71 75.5,73.46 X1.3
N$29
  Top 1.016: R110.2 77.84,55.4 R111.1
N$30
  Top 1.016: R100.2 92.84,55.4 R101.1
N$31
  Top 1.016: R120.2 62.84,55.4 R121.1
PM1_ADE
  Top 0.152: ADE9000.5 45.91,34.13 45.91,33.91 48.04,31.78 R2.2 47.33,30.23 47.02,30.23 46.71,29.92 46.71,28.99 45.81,28.09 ADUM4151.14
PM1_ISO
  Top 0.152: ADUM4151.7 12.95,28.09 5.84,35.2 4.9,35.2 4.32,35.78 4.32,36.72 3.3,37.74 2.36,37.74 1.78,38.32 1.78,56.92 2.36,57.5 3.76,57.5 JP1.35
REF
  Top 0.152: ADE9000.16 48.91,37.13 49.14,37.13 50.26,36 C4.1
  Top 0.254: C5.1 C4.1
RESET_ADE
  Top 0.152: ADE9000.6 46.41,34.13 46.41,33.91 48.49,31.83 48.94,31.83 49.82,30.95 C1.1 | ADUM4151.13 45.92,26.82 47.01,27.92 47.01,29.8 47.15,29.93 49.02,29.93 C1.1 | R3.1 C1.1
RESET_ISO
  Top 0.152: ADUM4151.8 13.22,26.82 6.3,33.74 6.3,34.06 5.47,34.9 4.78,34.9 4.02,35.65 4.02,36.59 3.18,37.44 2.24,37.44 1.48,38.19 1.48,57.05 2.24,57.8 3.64,57.8 4.32,58.49 4.32,59.46 5.31,60.45 JP1.37
SCLK_ADE
  Top 0.152: ADUM4151.18 30.19,33.17 30.2,33.17 32.04,33.17 32.21,33.17 33.89,33.17 34.02,33.3 34.02,34.59 36.04,36.61 37.29,36.61 37.65,36.25 ADE9000.37
SCLK_ISO
  Top 0.152: ADUM4151.3 15.89,33.17 11.87,33.17 9.65,35.39 9.65,40.25 7.34,42.56 6.56,42.56 JP1.23
SS_ADE
  Top 0.152: ADE9000.40 39.84,34.75 R1.1 34.46,29.36 ADUM4151.15
SS_ISO
  Top 0.152: ADUM4151.6 12.68,29.36 6.3,35.74 6.3,36.6 5.72,37.18 4.86,37.18 3.76,38.28 3.76,41.68 3.04,42.4 3.04,43.54 JP1.24
VAN
  Top 0.152: ADE9000.19 50.69,38.75 51.22,39.28 89.33,39.28 93.04,43 93.04,43.95 C101.1
  Top 0.305: C101.1 R200.1 C200.2
VAP
  Top 0.152: ADE9000.20 50.76,39.25 51.1,39.59 86.68,39.59 C101.2
  Top 0.305: C101.2 C100.2 R104.1
  Top 1.016: R104.1 91.04,50.05 R100.1
VBN
  Top 0.152: ADE9000.21 50.83,39.75 50.97,39.89 74.94,39.89 77.99,42.95 C111.1
  Top 0.305: 78.04,43.95 C111.1 R201.1 C201.2
VBP
  Top 0.152: ADE9000.22 47.91,39.87 47.91,40.09 48.07,40.25 72.35,40.25 C111.2
  Top 0.305: C111.2 C110.2 R114.1
  Top 1.016: R114.1 76.09,52.55 R110.1
VCN
  Top 0.152: ADE9000.23 47.41,39.87 47.41,40.09 47.88,40.56 60.6,40.56 63.04,43 63.04,43.95
  Top 0.305: 63.04,43.95 C121.1 R202.1 C202.2
VCP
  Top 0.152: ADE9000.24 46.91,39.87 46.91,40.09 47.68,40.86 57.96,40.86 C121.2
  Top 0.305: C121.2 C120.2 R124.1
  Top 1.016: R124.1 61.04,50.05 R120.1

### Text on the board
tNames: N | L3 | L2 | L1 | ADUM6404 | ADP122 | www.digitaldex.de